# Altium schematic sheet SPSGRFCsheet.SchDoc
size A
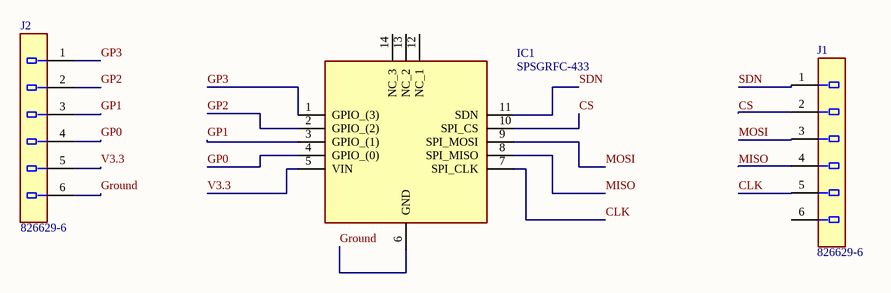
[diagram p0: SPSGRFCsheet.SchDoc]

## Parts
IC1  SPSGRFC-433  [SPSGRFC433]
J1  Part Number: 826629-6  [TE_C-826629_0]  (hidden comment: Conn_TE_826629-6_eec)
J2  Part Number: 826629-6  [TE_C-826629_0]  (hidden comment: Conn_TE_826629-6_eec)

## Nets
CLK: IC1.7(SPI_CLK) J1.5
CS: IC1.10(SPI_CS) J1.2
GP0: IC1.4(GPIO_(0)) J2.4
GP1: IC1.3(GPIO_(1)) J2.3
GP2: IC1.2(GPIO_(2)) J2.2
GP3: IC1.1(GPIO_(3)) J2.1
Ground: IC1.6(GND) J2.6
MISO: IC1.8(SPI_MISO) J1.4
MOSI: IC1.9(SPI_MOSI) J1.3
SDN: IC1.11(SDN) J1.1
V3.3: IC1.5(VIN) J2.5

Not connected (* = marked no-connect by the designer): IC1 12(NC_1) 13(NC_2) 14(NC_3); J1 6

## Library data of the parts
IC1 = SPSGRFC-433: Integrated Circuit; Manufacturer_Name: STMicroelectronics; Datasheet Link: https://www.st.com/resource/en/datasheet/spsgrfc.pdf; Height: 3mm; Manufacturer_Part_Number: SPSGRFC-433; Arrow Part Number: SPSGRFC-433; Arrow Price/Stock: https://www.arrow.com/en/products/spsgrfc-433/stmicroelectronics; Mouser Part Number: 511-SPSGRFC-433; Mouser Price/Stock: https://www.mouser.co.uk/ProductDetail/STMicroelectronics/SPSGRFC-433?qs=Mv7BduZupUhtphlGS%2FoEmw%3D%3D
J1 J2 = Conn_TE_826629-6_eec: CONN HEADER BRKWAWAY 6POS AU; Manufacturer: TE; Mfg Package Ident: C-826629; Symbol 0 0: Standard; Num Pins: 6; helpURL: https://upverter.com/upn/revision/017f1bdfe55378c0/; ComponentLink2Description: Datasheet; Temperature: to; Package: C-826629; Supplier 2: Mouser; Price: 0.393365307724; Supplier 1: Digi-Key; ComponentLink1URL: https://upverter.com/upn/revision/017f1bdfe55378c0/; Supplier Part Number 2: 571-826629-6; Supplier Part Number 1: A121495-ND; ComponentLink1Description: Upverter; ComponentLink2URL: http://www.te.com/commerce/DocumentDelivery/DDEController?Action=srchrtrv&DocNm=826629&DocType=Customer+Drawing&DocLang=English&DocFormat=pdf&PartCntxt=826629-6; RoHS: TRUE; Mouser Part Number: 571-826629-6; Ipc Land Pattern Name: SIP250W63P254L1524H711Q6; Digikey Description: CONN HEADER BRKWAWAY 6POS AU; Digikey Part Number: A121495-ND; Type: integrated circuit; Lead Free: yes